# EAGLE schematic mm16 (EAGLE 6.1)

## Sheet 1 of 2
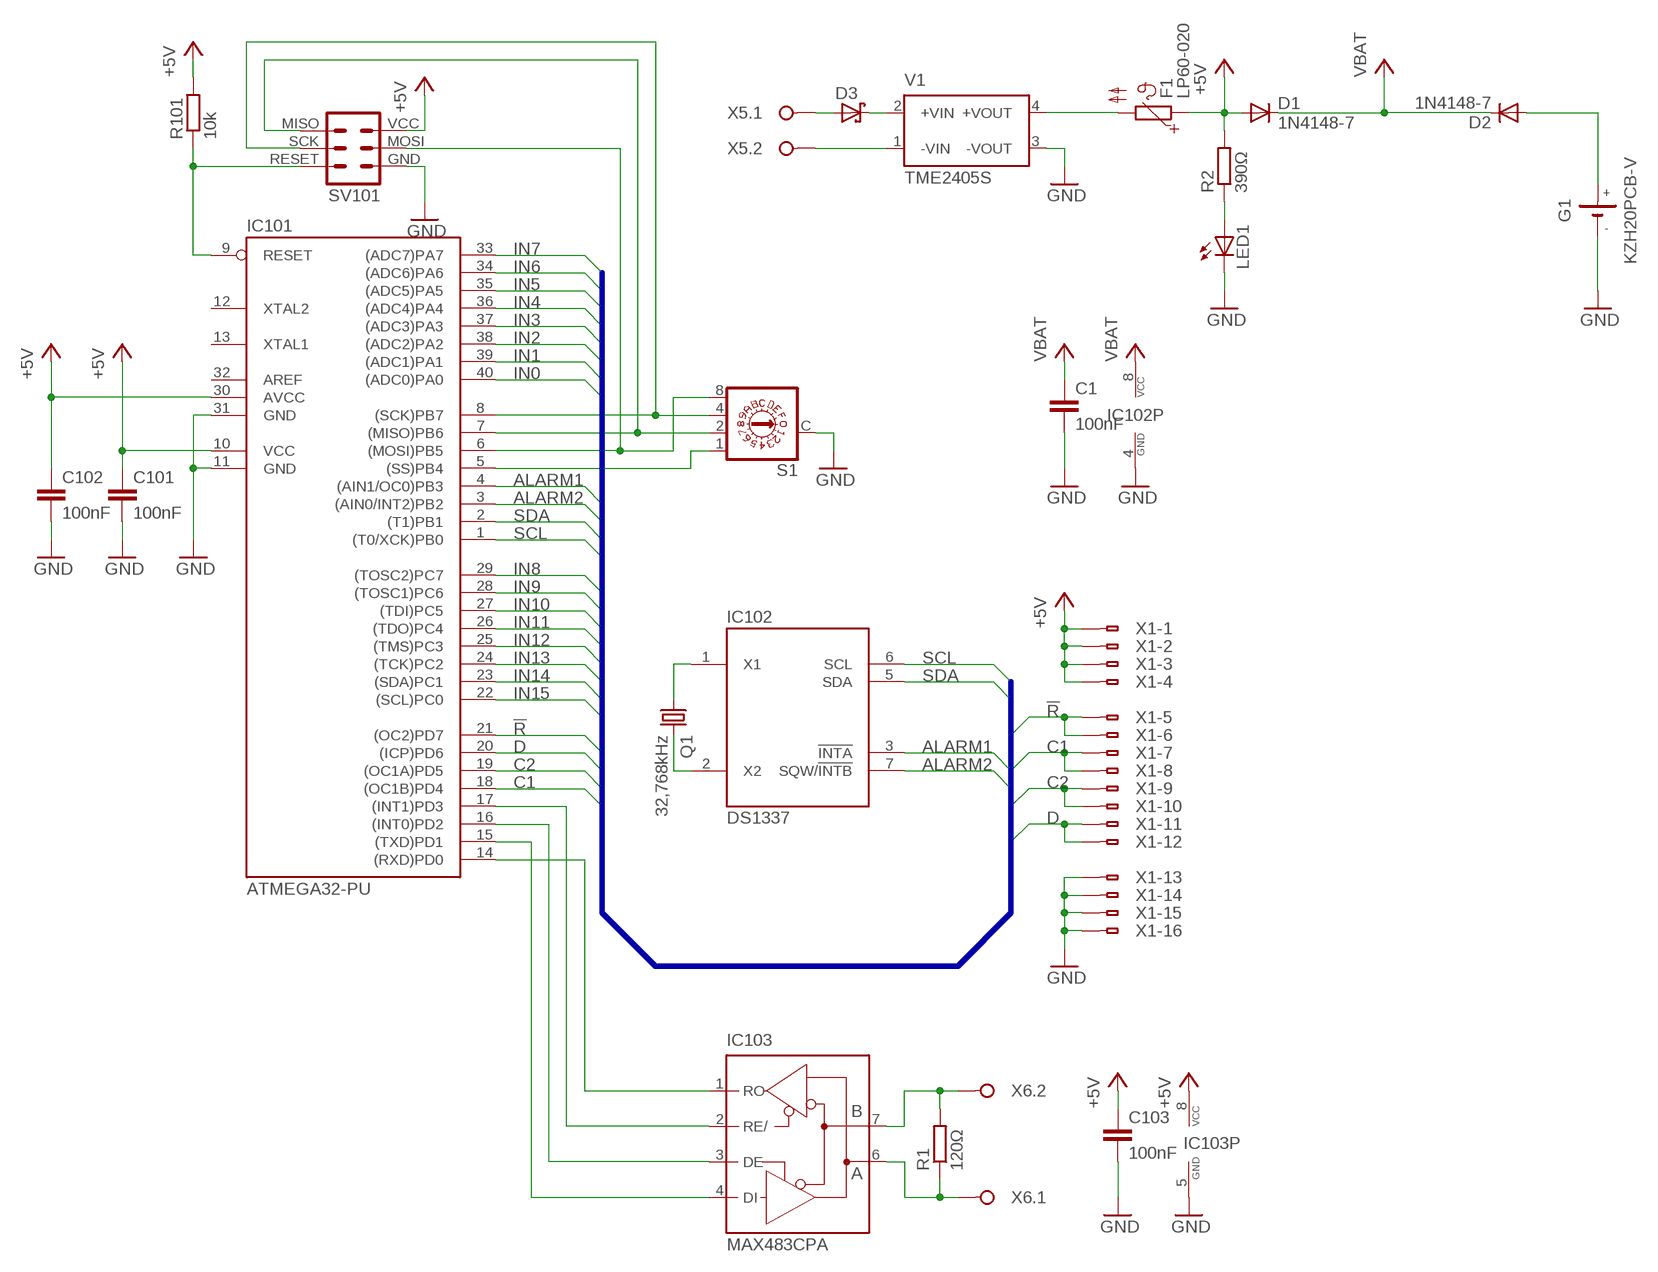
[diagram p0: schematic, sheet 1]

### Parts
C1  100nF  C_025-025X050  [C025-025X050]
C101  100nF  C_025-025X050  [C025-025X050]
C102  100nF  C_025-025X050  [C025-025X050]
C103  100nF  C_025-025X050  [C025-025X050]
D1  1N4148-7  [DO35-7@1]
D2  1N4148-7  [DO35-7@1]
D3  SCHOTTKY-DIODEDO35-7  [DO35-7]
F1  LP60-020  [LP60-020]
G1  KZH20PCB-V  [KZH20PCB-V]
IC101  ATMEGA32-PU  [DIL40]
IC102  DS1337  [DIL08]
IC103  MAX483CPA  [DIL08]
LED1  LED3MM  [LED3MM]
Q1  32,768kHz  Q_TC38H  [TC38H]
R1  120Ω  R_0204/2V  [0204V]
R2  390Ω  R_0204/2V  [0204V]
R101  10k  R_0204/2V  [0204V]
S1  P103  [P103]
SV101  AVR_ISP6  [ML6]
V1  TME2405S  [TME-24V]
X1  WS16V  [WS16V]
X5  WAGO_236-402  [WAGO_236-402]
X6  WAGO_236-402  [WAGO_236-402]

### Nets
!R: IC101.21((OC2)PD7) X1.5 X1.6
+5V: C101.1 C102.1 C103.1 D1.A F1.P$1 IC101.10(VCC) IC101.30(AVCC) IC103.8(VCC) R2.2 R101.2 SV101.VCC X1.1 X1.2 X1.3 X1.4
ALARM1: IC101.4((AIN1/OC0)PB3) IC102.3(!INTA)
ALARM2: IC101.3((AIN0/INT2)PB2) IC102.7(SQW/!INTB)
C1: IC101.18((OC1B)PD4) X1.7 X1.8
C2: IC101.19((OC1A)PD5) X1.9 X1.10
D: IC101.20((ICP)PD6) X1.11 X1.12
GND: C1.2 C101.2 C102.2 C103.2 G1.- IC101.11(GND) IC101.31(GND) IC102.4(GND) IC103.5(GND) LED1.K(C) S1.C SV101.GND V1.3(-VOUT) X1.13 X1.14 X1.15 X1.16 ; also sheet 2
IN0: IC101.40((ADC0)PA0) ; also sheet 2
IN1: IC101.39((ADC1)PA1) ; also sheet 2
IN2: IC101.38((ADC2)PA2) ; also sheet 2
IN3: IC101.37((ADC3)PA3) ; also sheet 2
IN4: IC101.36((ADC4)PA4) ; also sheet 2
IN5: IC101.35((ADC5)PA5) ; also sheet 2
IN6: IC101.34((ADC6)PA6) ; also sheet 2
IN7: IC101.33((ADC7)PA7) ; also sheet 2
IN8: IC101.29((TOSC2)PC7) ; also sheet 2
IN9: IC101.28((TOSC1)PC6) ; also sheet 2
IN10: IC101.27((TDI)PC5) ; also sheet 2
IN11: IC101.26((TDO)PC4) ; also sheet 2
IN12: IC101.25((TMS)PC3) ; also sheet 2
IN13: IC101.24((TCK)PC2) ; also sheet 2
IN14: IC101.23((SDA)PC1) ; also sheet 2
IN15: IC101.22((SCL)PC0) ; also sheet 2
N$19: V1.1(-VIN) X5.A2 X5.B2
N$20: IC103.6(A) R1.1 X6.A1 X6.B1
N$21: D2.A G1.+1(+) G1.+2(+)
N$22: IC103.7(B) R1.2 X6.A2 X6.B2
N$23: D3.C V1.2(+VIN)
N$24: D3.A X5.A1 X5.B1
N$41: F1.P$2 V1.4(+VOUT)
N$42: IC101.9(RESET) R101.1 SV101.RESET
N$44: LED1.A R2.1
N$61: IC101.15((TXD)PD1) IC103.4(DI)
N$62: IC101.14((RXD)PD0) IC103.1(RO)
N$63: IC101.17((INT1)PD3) IC103.2(RE/)
N$64: IC101.16((INT0)PD2) IC103.3(DE)
N$122: IC101.6((MOSI)PB5) S1.8 SV101.MOSI
N$123: IC101.7((MISO)PB6) S1.2 SV101.MISO
N$125: IC101.8((SCK)PB7) S1.4 SV101.SCK
N$126: IC102.1(X1) Q1.1
N$127: IC102.2(X2) Q1.2
N$130: IC101.5((SS)PB4) S1.1
SCL: IC101.1((T0/XCK)PB0) IC102.6(SCL)
SDA: IC101.2((T1)PB1) IC102.5(SDA)
VCC: C1.1 D1.C D2.C IC102.8(VCC) ; supply symbol labelled VBAT
Unconnected: IC101.12(XTAL2) IC101.13(XTAL1) IC101.32(AREF)

### Buses
IN[0..15],C1,C2,D,!R,SCL,SDA,ALARM1,ALARM2

## Sheet 2 of 2
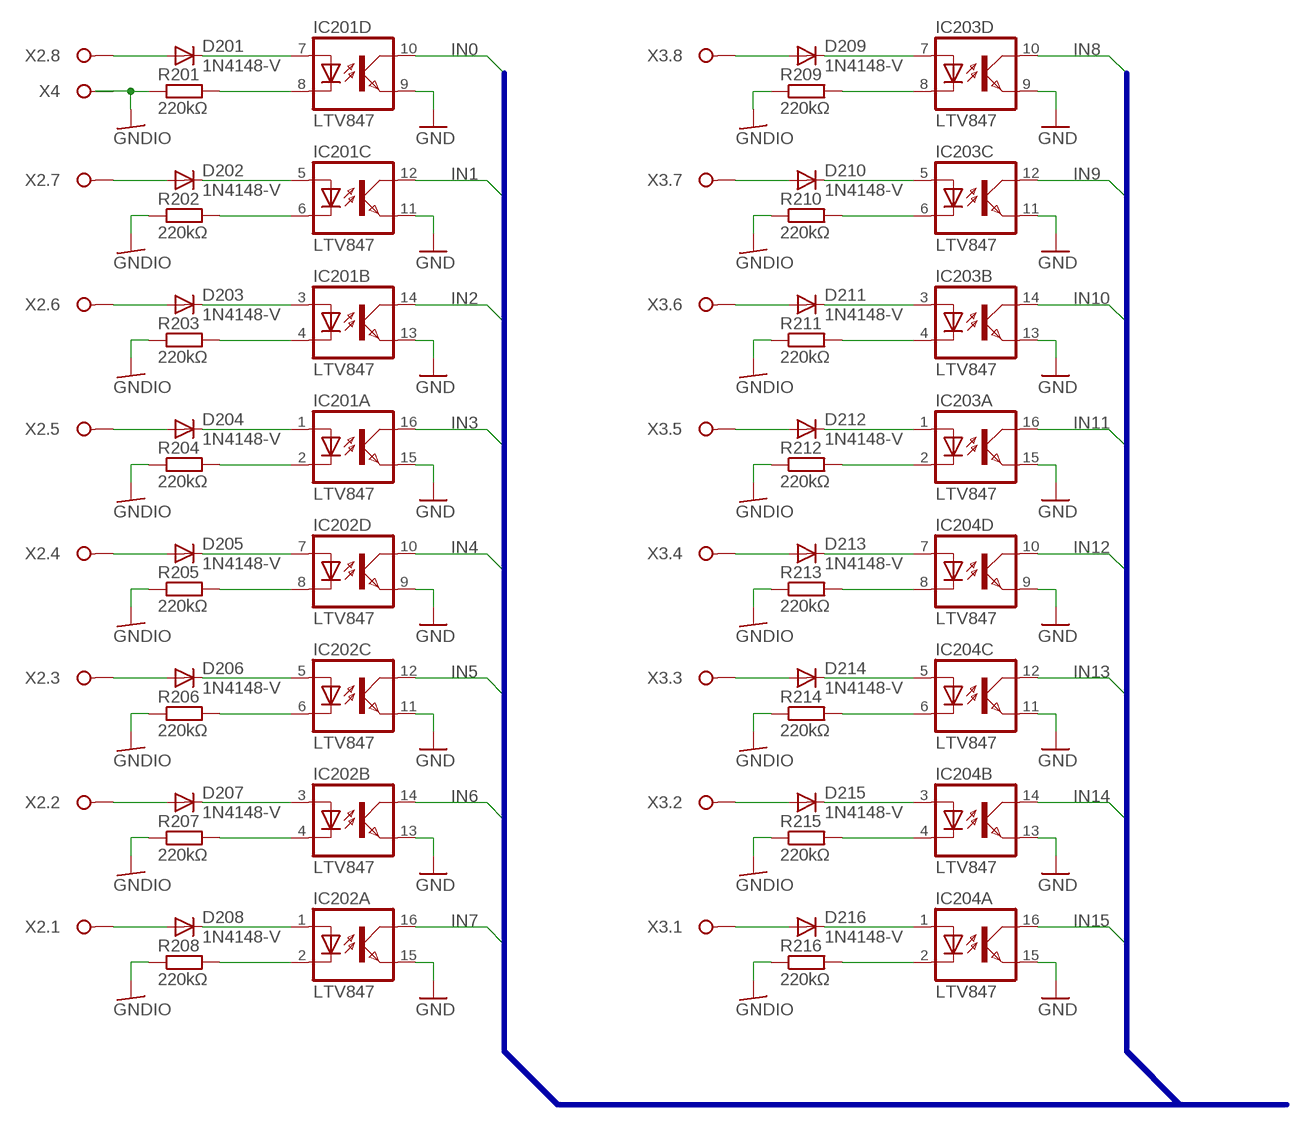
[diagram p1: schematic, sheet 2]

### Parts
D201  1N4148-V  [DO35-V]
D202  1N4148-V  [DO35-V]
D203  1N4148-V  [DO35-V]
D204  1N4148-V  [DO35-V]
D205  1N4148-V  [DO35-V]
D206  1N4148-V  [DO35-V]
D207  1N4148-V  [DO35-V]
D208  1N4148-V  [DO35-V]
D209  1N4148-V  [DO35-V]
D210  1N4148-V  [DO35-V]
D211  1N4148-V  [DO35-V]
D212  1N4148-V  [DO35-V]
D213  1N4148-V  [DO35-V]
D214  1N4148-V  [DO35-V]
D215  1N4148-V  [DO35-V]
D216  1N4148-V  [DO35-V]
IC201  LTV847  [DIL16]
IC202  LTV847  [DIL16]
IC203  LTV847  [DIL16]
IC204  LTV847  [DIL16]
R201  220kΩ  R_0204/2V  [0204V]
R202  220kΩ  R_0204/2V  [0204V]
R203  220kΩ  R_0204/2V  [0204V]
R204  220kΩ  R_0204/2V  [0204V]
R205  220kΩ  R_0204/2V  [0204V]
R206  220kΩ  R_0204/2V  [0204V]
R207  220kΩ  R_0204/2V  [0204V]
R208  220kΩ  R_0204/2V  [0204V]
R209  220kΩ  R_0204/2V  [0204V]
R210  220kΩ  R_0204/2V  [0204V]
R211  220kΩ  R_0204/2V  [0204V]
R212  220kΩ  R_0204/2V  [0204V]
R213  220kΩ  R_0204/2V  [0204V]
R214  220kΩ  R_0204/2V  [0204V]
R215  220kΩ  R_0204/2V  [0204V]
R216  220kΩ  R_0204/2V  [0204V]
X2  WAGO_236-408  [WAGO_236-408]
X3  WAGO_236-408  [WAGO_236-408]
X4  WAGO_236-401  [WAGO_236-401]

### Nets
GND: IC201.9(D:EMIT) IC201.11(C:EMIT) IC201.13(B:EMIT) IC201.15(A:EMIT) IC202.9(D:EMIT) IC202.11(C:EMIT) IC202.13(B:EMIT) IC202.15(A:EMIT) IC203.9(D:EMIT) IC203.11(C:EMIT) IC203.13(B:EMIT) IC203.15(A:EMIT) IC204.9(D:EMIT) IC204.11(C:EMIT) IC204.13(B:EMIT) IC204.15(A:EMIT) ; also sheet 1
GNDIO: R201.1 R202.1 R203.1 R204.1 R205.1 R206.1 R207.1 R208.1 R209.1 R210.1 R211.1 R212.1 R213.1 R214.1 R215.1 R216.1 X4.A1(A) X4.B1(B)
IN0: IC201.10(D:COL) ; also sheet 1
IN1: IC201.12(C:COL) ; also sheet 1
IN2: IC201.14(B:COL) ; also sheet 1
IN3: IC201.16(A:COL) ; also sheet 1
IN4: IC202.10(D:COL) ; also sheet 1
IN5: IC202.12(C:COL) ; also sheet 1
IN6: IC202.14(B:COL) ; also sheet 1
IN7: IC202.16(A:COL) ; also sheet 1
IN8: IC203.10(D:COL) ; also sheet 1
IN9: IC203.12(C:COL) ; also sheet 1
IN10: IC203.14(B:COL) ; also sheet 1
IN11: IC203.16(A:COL) ; also sheet 1
IN12: IC204.10(D:COL) ; also sheet 1
IN13: IC204.12(C:COL) ; also sheet 1
IN14: IC204.14(B:COL) ; also sheet 1
IN15: IC204.16(A:COL) ; also sheet 1
N$1: D201.2(C) IC201.7(D:A)
N$2: IC201.8(D:C) R201.2
N$3: D202.2(C) IC201.5(C:A)
N$4: IC201.6(C:C) R202.2
N$5: D203.2(C) IC201.3(B:A)
N$6: IC201.4(B:C) R203.2
N$7: D204.2(C) IC201.1(A:A)
N$8: IC201.2(A:C) R204.2
N$9: D205.2(C) IC202.7(D:A)
N$10: IC202.8(D:C) R205.2
N$11: D206.2(C) IC202.5(C:A)
N$12: IC202.6(C:C) R206.2
N$13: D207.2(C) IC202.3(B:A)
N$14: IC202.4(B:C) R207.2
N$15: D208.2(C) IC202.1(A:A)
N$16: IC202.2(A:C) R208.2
N$25: D209.2(C) IC203.7(D:A)
N$26: IC203.8(D:C) R209.2
N$27: D210.2(C) IC203.5(C:A)
N$28: IC203.6(C:C) R210.2
N$29: D211.2(C) IC203.3(B:A)
N$30: IC203.4(B:C) R211.2
N$31: D212.2(C) IC203.1(A:A)
N$32: IC203.2(A:C) R212.2
N$33: D213.2(C) IC204.7(D:A)
N$34: IC204.8(D:C) R213.2
N$35: D214.2(C) IC204.5(C:A)
N$36: IC204.6(C:C) R214.2
N$37: D215.2(C) IC204.3(B:A)
N$38: IC204.4(B:C) R215.2
N$39: D216.2(C) IC204.1(A:A)
N$40: IC204.2(A:C) R216.2
N$50: D204.1(A) X2.A5 X2.B5
N$52: D203.1(A) X2.A6 X2.B6
N$55: D202.1(A) X2.A7 X2.B7
N$57: D201.1(A) X2.A8 X2.B8
N$65: D205.1(A) X2.A4 X2.B4
N$67: D206.1(A) X2.A3 X2.B3
N$69: D207.1(A) X2.A2 X2.B2
N$71: D208.1(A) X2.A1 X2.B1
N$73: D216.1(A) X3.A1 X3.B1
N$77: D215.1(A) X3.A2 X3.B2
N$79: D214.1(A) X3.A3 X3.B3
N$81: D213.1(A) X3.A4 X3.B4
N$83: D212.1(A) X3.A5 X3.B5
N$85: D211.1(A) X3.A6 X3.B6
N$86: D209.1(A) X3.A8 X3.B8
N$88: D210.1(A) X3.A7 X3.B7

### Buses
IN[0..15],OUT[0..7]

## Library data of the parts
C1 C101-C103 = passiv:C_: CAPACITOR, European symbol
D1 D2 D201-D216 = diode:1N4148: Universal Gleichrichterdiode 1n914_1n916_1n4148_1n4448.pdf <./eagle/doc/diode/1n914_1n916_1n4148_1n4448.pdf>
D3 = diode:SCHOTTKY-DIODE: Schottky Diode
F1 = sicherung:LP60: Polymer PTC Datasheet: lp60.pdf <./eagle/doc/sicherung/lp60.pdf>
G1 = batterie:KZH20: Knopfzellenhalter
IC101 = ic-mcu:ATMEGA32: MICROCONTROLLER 32 Kbytes FLASH 2 Kbytes SRAM 1 Kbytes EEPROM USART 8-channel 10 bit ADC Source: www.atmel.com .. doc2503.pdf
IC102 = ic-controller:DS1337: Echtzeituhr Datasheet: ds1337.pdf <./eagle/doc/ic-controller/ds1337.pdf>
IC103 = ic-wandler:MAX48*: RS485 TRANSEIVER Datasheet: max1487-max491.pdf <./eagle/doc/ic-wandler/max1487-max491.pdf> Part Number Half- / Fullduplex Datarate (Mbps) Slew-Rate limited Low-Power shutdown Receiver / Driver enable Quiescent current (μA) Number of Receivers un bus MAX481 Half 2.5 No Yes Yes 300 32 MAX483 Half 0.25 Yes Yes Yes 120 32 MAX485 Half 2.5 No No Yes 300 32 MAX487 Half 0.25 Yes Yes Yes 120 128
IC201-IC204 = ic-optokoppler:LTV847: Liteon Optokoppler ltv-817_827_847.pdf <./eagle/doc/ic-optokoppler/ltv-817_827_847.pdf>
LED1 = led:LED: LED
Q1 = passiv:Q_: CRYSTAL
R1 R2 R101 R201-R216 = passiv:R_: RESISTOR, European symbol
S1 = switch-dil:P103: DIL/CODE SWITCH; OC_FARNELL: unknown; OC_NEWARK: unknown
SV101 = stecker:AVR_ISP6: HARTING
V1 = schaltregler:TME?*: DC/DC Converter TME Series 1 Watt traco_tme.pdf <./eagle/doc/schaltregler/traco_tme.pdf>; MPN: TME 2405S; OC_FARNELL: 1007547; OC_NEWARK: 51R5329
X1 = anschluss:WS16: Wannenstecker 16polig
X2 X3 = anschluss:WAGO_236-408: Anschlussklemme Datasheet: wago236.pdf <./eagle/doc/anschluss/wago236.pdf>
X4 = anschluss:WAGO_236-401: Anschlussklemme Datasheet: wago236.pdf <./eagle/doc/anschluss/wago236.pdf>
X5 X6 = anschluss:WAGO_236-402: Anschlussklemme Datasheet: wago236.pdf <./eagle/doc/anschluss/wago236.pdf>